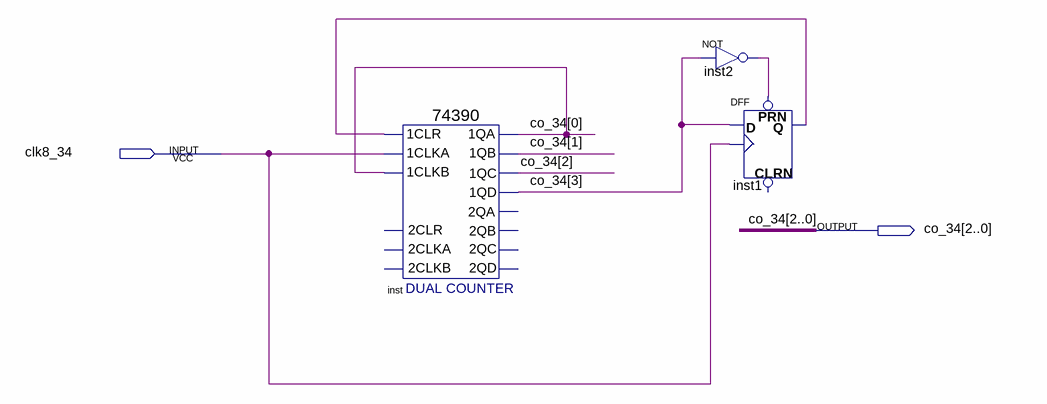
[diagram p0: schematic sheet]
// Quartus schematic m6.bdf as structural Verilog: 3 symbols, 2 pins
module m6 (
  input  clk8_34,
  output [3:0] co_34
);

  wire inst1_q, inst2_out;

  \74390  inst (
    .\1CLR (inst1_q), .\1CLKA (clk8_34), .\1CLKB (co_34[0]), .\1QA (co_34[0]), .\1QB (co_34[1]),
    .\1QC (co_34[2]), .\1QD (co_34[3]));  // open: 2CLKA, 2CLR, 2CLKB, 2QA, 2QB, 2QC, 2QD
  not inst2 (inst2_out, co_34[3]);
  DFF inst1 (.CLK(clk8_34), .D(co_34[3]), .PRN(inst2_out), .Q(inst1_q));  // open: CLRN
endmodule
